# EAGLE design RTDPlug (EAGLE 7.2.0)
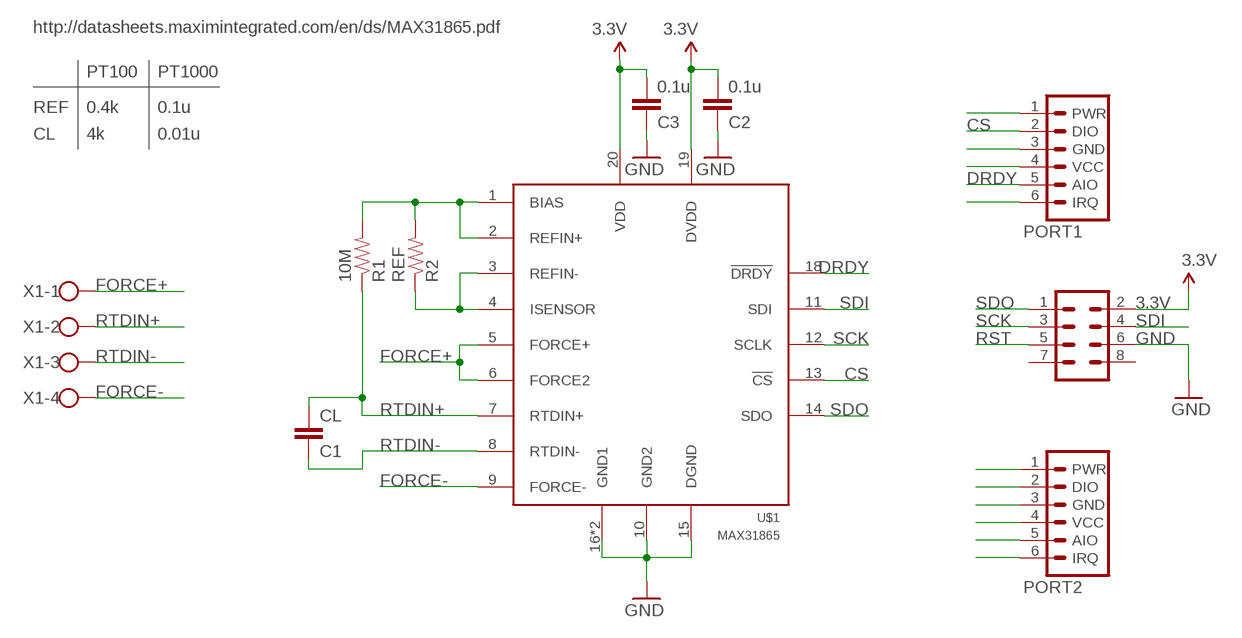
[diagram p0: schematic, sheet 1]

## Parts
C1  CL  CAP0603-CAP  [0603-CAP]
C2  0.1u  CAP0603-CAP  [0603-CAP]
C3  0.1u  CAP0603-CAP  [0603-CAP]
ISP  MA04-2  [MA04-2]
PORT1  JEEPORT-FEMALE  [1X06_FEMALE_LOCK.010]
PORT2  JEEPORT-FEMALE  [1X06_FEMALE_LOCK.010]
R1  10M  RESISTOR0603-RES  [0603-RES]
R2  REF  RESISTOR1206  [1206]
U$1  MAX31865  [TQFN20-5X5]
X1  W237-4  [W237-4]

## Nets
3.3V: C2.2 C3.2 ISP.2 U$1.19(DVDD) U$1.20(VDD)
CS: PORT1.2(DIO) U$1.13(!CS)
DRDY: PORT1.5(AIO) U$1.18(!DRDY)
FORCE+: U$1.5(FORCE+) U$1.6(FORCE2) X1.1
FORCE-: U$1.9(FORCE-) X1.4
GND: C2.1 C3.1 ISP.6 U$1.10(GND2) U$1.15(DGND) U$1.16(GND1) U$1.EXP(GND1)
N$1: PORT2.1(PWR)
N$2: PORT2.2(DIO)
N$3: R1.2 R2.2 U$1.1(BIAS) U$1.2(REFIN+)
N$4: R2.1 U$1.3(REFIN-) U$1.4(ISENSOR)
N$5: PORT2.3(GND)
N$6: PORT2.4(VCC)
N$7: PORT2.5(AIO)
N$8: PORT2.6(IRQ)
N$9: PORT1.3(GND)
N$10: PORT1.1(PWR)
N$11: PORT1.4(VCC)
N$12: PORT1.6(IRQ)
RST: ISP.5
RTDIN+: C1.2 R1.1 U$1.7(RTDIN+) X1.2
RTDIN-: C1.1 U$1.8(RTDIN-) X1.3
SCK: ISP.3 U$1.12(SCLK)
SDI: ISP.4 U$1.11(SDI)
SDO: ISP.1 U$1.14(SDO)
Unconnected: ISP.7 ISP.8

## Notes on the sheet
- http://datasheets.maximintegrated.com/en/ds/MAX31865.pdf
- PT100 | PT1000
- REF | 0.4k | 0.1u
- CL | 4k | 0.01u

## Library data of the parts
C1-C3 = SparkFun:CAP: Capacitor Standard 0603 ceramic capacitor, and 0.1" leaded capacitor.
ISP = JeeLabs:MA04-2: PIN HEADER
PORT1 PORT2 = JeeParts:JEEPORT: PIN HEADER
R1 R2 = SparkFun:RESISTOR: Resistor Basic schematic elements and footprints for 0603, 1206, and PTH resistors.
U$1 = Oles komponentbibliotek:MAX31865: RTD to Digital Converter The MAX31865 is a resistance-to-digital converter optimized for platinum resistance temperature detectors (RTDs). An external resistor sets the sensitivity for the RTD being used and a delta-sigma ADC converts the ratio of the RTD resistance to the reference resistance into digital form. The MAX31865’s inputs are protected against overvoltage faults up to +/-50V. Programmable detection of RTD and cable open and short conditions is included.
X1 = con-wago-500:W237-4: WAGO SCREW CLAMP; OC_FARNELL: unknown; OC_NEWARK: unknown

## Net classes
1 power: width 0.381 mm, clearance 0.254 mm

## Board
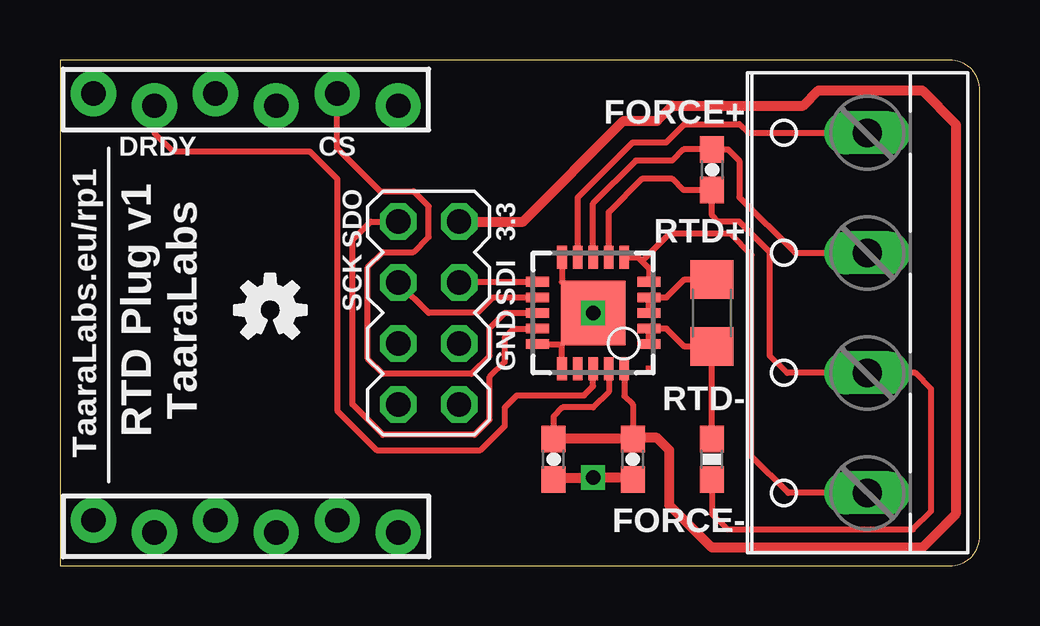
[diagram p1: board, top side]
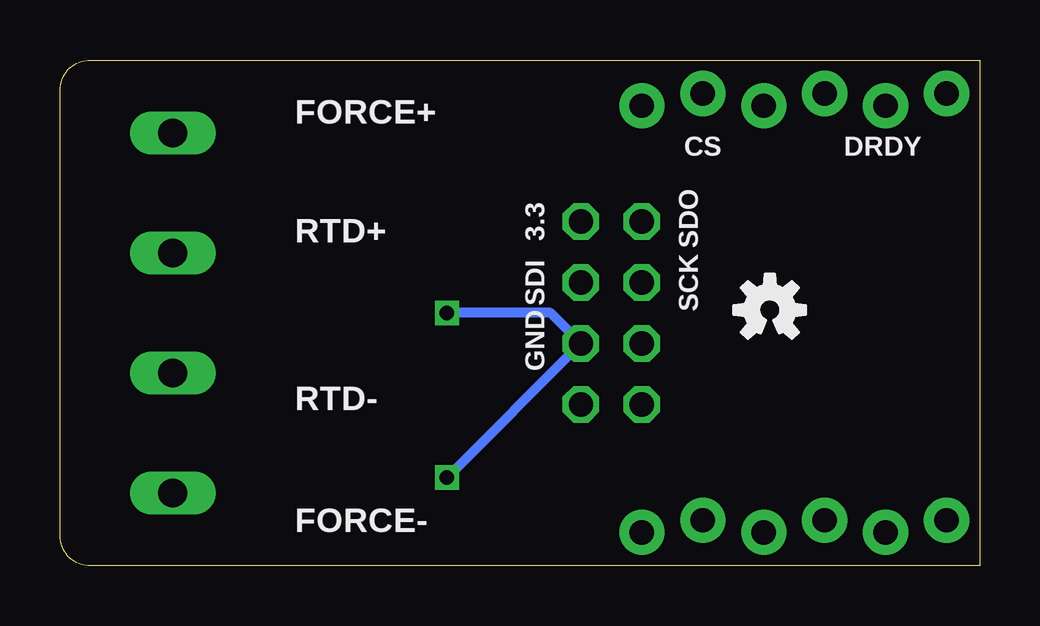
[diagram p2: board, bottom side, seen from below]

Size 38.35 x 21.08 mm. Coordinates in mm from the lower left corner, seen from the top.
Outline: 37.08,21.08 0,21.08 0,0 37.08,0 arc90 38.35,1.27 38.35,19.81 arc90 37.08,21.08
Copper layers (1*16): Top 0.035mm / dielectric 1.5mm / Bottom 0.035mm
Design rules "default": minimum track width 10mil, minimum drill 24mil, track to track 8mil, track to pad 8mil, pad to pad 8mil, via to via 8mil, smd to smd 8mil, copper to edge 40mil, drill to drill 8mil, minimum pad ring 10mil, minimum via ring 8mil, stop-mask expansion 4mil, vias tented up to drill 0mil, thermal gap 10mil

### Footprints (pad centres in the part's own frame; a part is rotated, then mirrored left to right if it is on the bottom)
0603-CAP = smd 1.1 x 1: 1 -0.85,0; 2 0.85,0
MA04-2 = drill 1.016 octagon: 1 -3.81,-1.27; 2 -3.81,1.27; 3 -1.27,-1.27; 4 -1.27,1.27; 5 1.27,-1.27; 6 1.27,1.27; 7 3.81,-1.27; 8 3.81,1.27
1X06_FEMALE_LOCK.010 = drill 1.016 pad 1.88: 1 0,0.254; 2 2.54,-0.254; 3 5.08,0.254; 4 7.62,-0.254; 5 10.16,0.254; 6 12.7,-0.254
0603-RES = smd 1.1 x 1: 1 -0.85,0; 2 0.85,0
1206 = smd 1.6 x 1.8: 1 -1.4,0; 2 1.4,0
TQFN20-5X5 = smd 0.95 x 0.4: 1 -2.325,1.3; 2 -2.325,0.65; 3 -2.325,0; 4 -2.325,-0.65; 5 -2.325,-1.3; 11 2.325,-1.3; 12 2.325,-0.65; 13 2.325,0; 14 2.325,0.65; 15 2.325,1.3 | smd 0.4 x 0.95: 6 -1.3,-2.325; 7 -0.65,-2.325; 8 0,-2.325; 9 0.65,-2.325; 10 1.3,-2.325; 16 1.3,2.325; 17 0.65,2.325; 18 0,2.325; 19 -0.65,2.325; 20 -1.3,2.325 | smd 2.7 x 2.7: EXP 0,0
W237-4 = drill 1.194 long: 1 -7.5,-1.27; 2 -2.5,-1.27; 3 2.5,-1.27; 4 7.5,-1.27

### Placement (x,y rotation side)
C1  27.18,16.51 270 top
C2  20.57,4.44 90 top
C3  23.88,4.44 90 top
ISP  15.37,10.54 270 top
PORT1  14.1,19.43 180 top
PORT2  1.4,1.65 0 top
R1  27.18,4.44 90 top
R2  27.18,10.54 270 top
U$1  22.22,10.54 180 top
U$2  [OSHW-LOGO-S]  8.76,10.67 0 top
U$3  [OSHW-LOGO-S]  8.76,10.67 0 bottom
X1  32.39,10.54 90 top

### Tracks (layer width: path | path; a pad name or v marks a point on that pad's centre or on a via)
3.3V
  Top 0.254: 23.53,5.58 C3.2 23.88,6.73 23.53,7.08 U$1.20 | U$1.19 22.88,7.25 22.22,6.6 20.95,6.6 20.57,6.22 C2.2
  Top 0.406: 20.66,5.46 C2.2 C3.2 23.79,5.33 24.89,5.33 25.4,4.83 25.4,2.54 27.18,0.76 35.94,0.76 37.34,2.16 37.34,18.41 35.94,19.81 31.62,19.81 30.99,19.18 25.53,19.18 24.89,18.54 23.5,18.54 19.3,14.35 ISP.2
CS
  Top 0.254: PORT1.2 11.56,17.4 13.34,15.62 14.73,15.62 15.37,14.99 15.37,13.72 14.73,13.08 13.46,13.08 12.83,12.45 12.83,8.64 13.46,8 17.14,8 17.91,8.76 17.91,9.91 18.54,10.54 U$1.13
DRDY
  Top 0.254: U$1.18 22.22,7.49 21.84,7.11 19.05,7.11 18.54,6.6 18.54,5.84 17.53,4.83 13.21,4.83 11.56,6.48 11.56,16.13 10.41,17.27 4.7,17.27 3.94,18.03 PORT1.5
FORCE+
  Top 0.254: U$1.6 24.09,12.87 24.26,12.7 | 24.26,12.7 24.55,12.41 U$1.5 | X1.1 30.36,3.04 28.83,4.57 28.83,12.95 27.94,13.84 25.4,13.84 24.26,12.7
FORCE-
  Top 0.254: U$1.9 21.58,15.35 23.88,17.65 25.27,17.65 26.03,18.41 28.32,18.41 28.7,18.04 X1.4
GND  (via drill 0.6)
  Top 0.254: U$1.15 20.92,9.24 | U$1.16 20.92,9.24 | 20.92,9.24 U$1.EXP 20.92,11.84 U$1.10
  Top 0.406: U$1.EXP 21.84,10.16 | C2.1 20.7,3.68 v22.22,3.68 23.33,3.68 C3.1
  Bottom 0.406: U$1.EXP 17.91,10.54 ISP.6 v22.22,3.68
  other vias: 22.22,10.54
N$3
  Top 0.254: U$1.1 U$1.2 25.29,9.89 26.04,9.14 R2.2 R1.2
N$4
  Top 0.254: U$1.3 U$1.4 25.29,11.19 26.04,11.94 R2.1
RTDIN+
  Top 0.254: R1.1 27.18,2.16 27.81,1.52 35.56,1.52 36.32,2.29 36.32,7.37 35.65,8.04 X1.2 30.31,8.04 29.59,8.76 29.59,13.08 28.32,14.35 27.43,14.35 27.18,14.61 C1.2 26,15.66 25.53,16.13 24.26,16.13 22.88,14.75 U$1.7
RTDIN-
  Top 0.254: U$1.8 22.22,15.11 24,16.89 25.53,16.89 26,17.36 C1.1 27.85,17.36 28.32,16.89 28.32,15.37 30.65,13.04 X1.3
SCK
  Top 0.254: ISP.3 15.37,10.54 17.4,10.54 18.05,11.19 U$1.12
SDI
  Top 0.254: ISP.4 16.67,11.84 U$1.11
SDO
  Top 0.254: ISP.1 12.95,14.35 12.19,13.59 12.19,6.73 13.46,5.46 17.27,5.46 17.91,6.1 17.91,7.87 18.54,8.51 18.54,9.53 18.91,9.89 U$1.14

### Text on the board
tNames: DRDY | CS | FORCE+ | SDO | 3.3 | RTD+ | SCK | SDI | GND | RTD- | FORCE- | FORCE-
bNames: FORCE+ | DRDY | CS | SDO | 3.3 | RTD+ | SCK | SDI | GND | RTD- | FORCE-
_tsilk: RTD Plug v1 | TaaraLabs | TaaraLabs.eu/rp1
_bsilk: RTD Plug v1 | TaaraLabs | TaaraLabs.eu/rp1